# EAGLE design fa3d_Dock_NEW_Small (EAGLE 9.4.2)
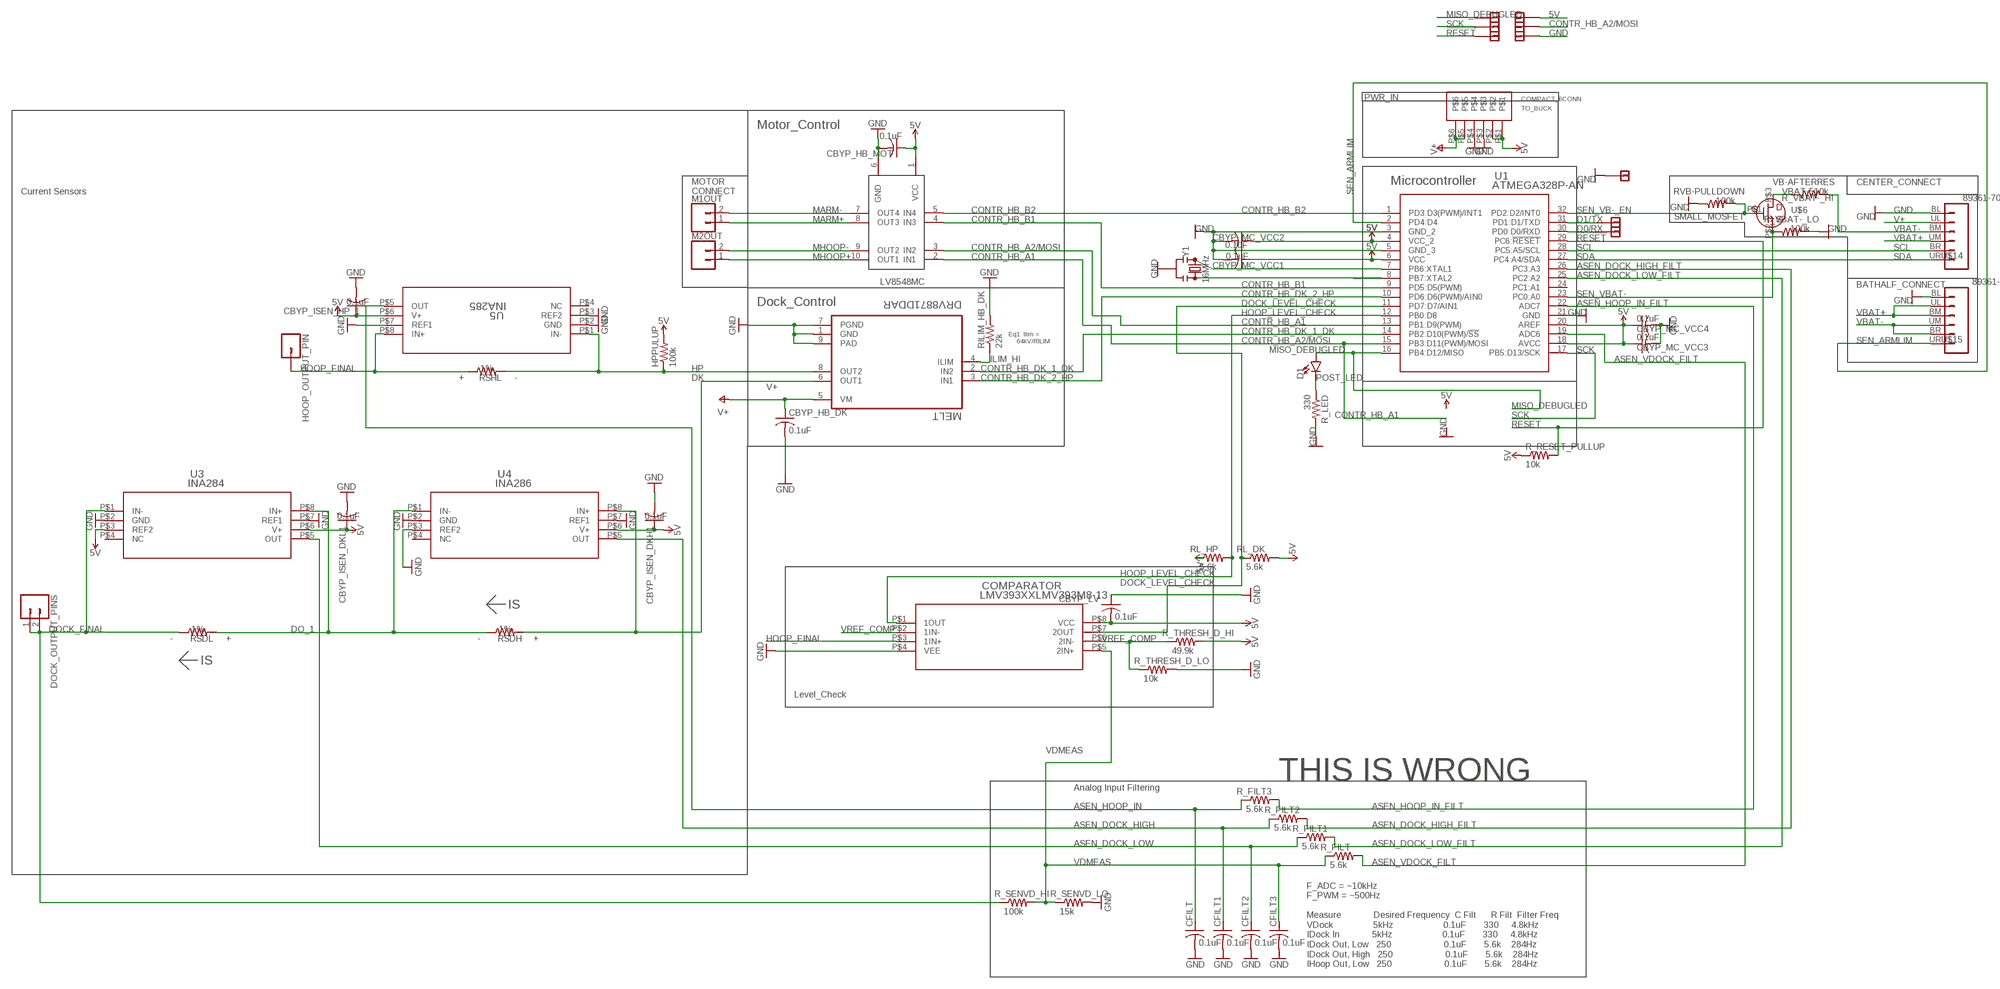
[diagram p0: schematic, sheet 1, part 1 of 2]
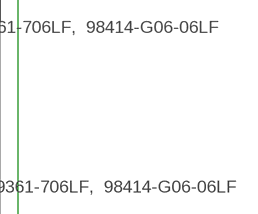
[diagram p1: schematic, sheet 1, part 2 of 2]

## Parts
CBYP_HB_DK  0.1uF  C-USC0603  [C0603]
CBYP_HB_MOT  0.1uF  C-USC0402  [C0402]
CBYP_ISEN_DKH1  0.1uF  C-USC0402  [C0402]
CBYP_ISEN_DKL1  0.1uF  C-USC0402  [C0402]
CBYP_ISEN_HP_1  0.1uF  C-USC0402  [C0402]
CBYP_LV  0.1uF  C-USC0402  [C0402]
CBYP_MC_VCC1  0.1uF  C-USC0402  [C0402]
CBYP_MC_VCC2  0.1uF  C-USC0402  [C0402]
CBYP_MC_VCC3  0.1uF  C-USC0402  [C0402]
CBYP_MC_VCC4  0.1uF  C-USC0402  [C0402]
CFILT  0.1uF  C-USC0402  [C0402]
CFILT1  0.1uF  C-USC0402  [C0402]
CFILT2  0.1uF  C-USC0402  [C0402]
CFILT3  0.1uF  C-USC0402  [C0402]
COMPARATOR  LMV393XXLMV393M8-13  [MSOP-8]
D1  LED0603  [LED-0603]
DOCK_OUTPUT_PINS  CONN_02  [1X02]
HOOP_OUTPUT_PIN  CONN_01  [1X01]
HPPULUP  100k  R-US_R0402  [R0402]
M1OUT  CONN_02  [1X02]
M2OUT  CONN_02  [1X02]
MELT  DRV8871DDAR  [SOIC127P600X170-8N]
MOTOR  LV8548MC-AH  [10-SOP]
R_FILT  5.6k  R-US_R0402  [R0402]
R_FILT1  5.6k  R-US_R0402  [R0402]
R_FILT2  5.6k  R-US_R0402  [R0402]
R_FILT3  5.6k  R-US_R0402  [R0402]
R_LED  330  R-US_R0402  [R0402]
R_RESET_PULLUP  10k  R-US_R0402  [R0402]
R_SENVD_HI  100k  R-US_R0402  [R0402]
R_SENVD_LO  15k  R-US_R0402  [R0402]
R_THRESH_D_HI  49.9k  R-US_R0402  [R0402]
R_THRESH_D_LO  10k  R-US_R0402  [R0402]
R_VBAT-_HI  510k  R-US_R0402  [R0402]
R_VBAT-_LO  100k  R-US_R0402  [R0402]
RILIM_HB_DK  22k  R-US_R0603  [R0603]
RL_DK  5.6k  R-US_R0402  [R0402]
RL_HP  5.6k  R-US_R0402  [R0402]
RSDH  25m  R-US_R0603  [R0603]
RSDL  25m  R-US_R0603  [R0603]
RSHL  25m  R-US_R0603  [R0603]
RVB-PULLDOWN  100k  R-US_R0402  [R0402]
TO_BUCK  COMPACT_6CONN  [COMPACT_6CONN]
U1  ATMEGA328P-AN  [32A]
U3  INA284  INA28XSMALL  [8-VSSOP]
U4  INA286  INA28XSMALL  [8-VSSOP]
U5  INA285  INA28XSMALL  [8-VSSOP]
U$1  SIMPLE_VIA_CONNECTION  [SIMPLEVIA]
U$2  SIMPLE_VIA_CONNECTION  [SIMPLEVIA]
U$3  SIMPLE_VIA_CONNECTION  [SIMPLEVIA]
U$4  SIMPLE_VIA_CONNECTION  [SIMPLEVIA]
U$5  SIMPLE_VIA_CONNECTION  [SIMPLEVIA]
U$6  SMALL_MOSFET  [SOT-23]
U$7  SIMPLE_VIA_CONNECTION  [SIMPLEVIA]
U$8  SIMPLE_VIA_CONNECTION  [SIMPLEVIA]
U$9  SIMPLE_VIA_CONNECTION  [SIMPLEVIA]
U$10  SIMPLE_VIA_CONNECTION  [SIMPLEVIA]
U$14  89361-706LF, 98414-G06-06LF  CONNECTORHEADERTHROUGHHOLE6POSITION0.079"(2.00MM)  [2X3_2MMPITCH]
U$15  89361-706LF, 98414-G06-06LF  CONNECTORHEADERTHROUGHHOLE6POSITION0.079"(2.00MM)  [2X3_2MMPITCH]
Y1  16MHz  RESONATOR-16MHZSMD_3.2X1.3  [RESONATOR-SMD-3.2X1.3]

## Nets
5V [Analog_Signal]: CBYP_HB_MOT.1 CBYP_ISEN_DKH1.1 CBYP_ISEN_DKL1.1 CBYP_ISEN_HP_1.1 CBYP_LV.2 CBYP_MC_VCC1.1 CBYP_MC_VCC2.1 CBYP_MC_VCC3.1 CBYP_MC_VCC4.1 COMPARATOR.P$8(VCC) HPPULUP.2 MOTOR.1(VCC) R_RESET_PULLUP.1 R_THRESH_D_HI.2 RL_DK.2 RL_HP.1 TO_BUCK.P$1 TO_BUCK.P$2 U1.4(VCC_2) U1.6(VCC) U1.18(AVCC) U1.20(AREF) U3.P$3(REF2) U3.P$6(V+) U4.P$6(V+) U5.P$6(V+) U$10.P$1
!RESET [Digital_Signal]: R_RESET_PULLUP.2 U1.29(PC6:!RESET) U$7.P$1
ASEN_DOCK_HIGH [Analog_Signal]: CFILT1.1 R_FILT2.1 U4.P$5(OUT)
ASEN_DOCK_HIGH_FILT [Analog_Signal]: R_FILT2.2 U1.26(PC3:A3)
ASEN_DOCK_LOW [Analog_Signal]: CFILT2.1 R_FILT1.1 U3.P$5(OUT)
ASEN_DOCK_LOW_FILT [Analog_Signal]: R_FILT1.2 U1.25(PC2:A2)
ASEN_HOOP_IN [Analog_Signal]: CFILT.1 R_FILT3.1 U5.P$5(OUT)
ASEN_HOOP_IN_FILT [Analog_Signal]: R_FILT3.2 U1.22(ADC7)
ASEN_VDOCK_FILT [Analog_Signal]: R_FILT.2 U1.19(ADC6)
CONTR_HB_A1 [Digital_Signal]: MOTOR.2(IN1) U1.15(PB3:D11(PWM)/MOSI)
CONTR_HB_A2/MOSI [Digital_Signal]: MOTOR.3(IN2) U1.13(PB1:D9(PWM)) U$9.P$1
CONTR_HB_B1 [Digital_Signal]: MOTOR.4(IN3) U1.9(PD5:D5(PWM))
CONTR_HB_B2 [Digital_Signal]: MOTOR.5(IN4) U1.1(PD3:D3(PWM)/INT1)
CONTR_HB_DK_1_DK [Digital_Signal]: MELT.2(IN2) U1.14(PB2:D10(PWM)/!SS)
CONTR_HB_DK_2_HP [Digital_Signal]: MELT.3(IN1) U1.10(PD6:D6(PWM)/AIN0)
D0/RX [Communication]: U1.30(PD0:D0/RXD) U$5.P$1
D1/TX [Communication]: U1.31(PD1:D1/TXD) U$4.P$1
DK [Power_Signal]: MELT.6(OUT1) RSDH.2 U4.P$8(IN+)
DO_1 [Communication]: RSDH.1 RSDL.2 U3.P$8(IN+) U4.P$1(IN-)
DOCK_FINAL [Communication]: DOCK_OUTPUT_PINS.1 DOCK_OUTPUT_PINS.2 R_SENVD_HI.1 RSDL.1 U3.P$1(IN-)
DOCK_LEVEL_CHECK [Digital_Signal]: COMPARATOR.P$7(2OUT) RL_DK.1 U1.11(PD7:D7/AIN1)
GND [Digital_Signal]: CBYP_HB_DK.2 CBYP_HB_MOT.2 CBYP_ISEN_DKH1.2 CBYP_ISEN_DKL1.2 CBYP_ISEN_HP_1.2 CBYP_LV.1 CBYP_MC_VCC1.2 CBYP_MC_VCC2.2 CBYP_MC_VCC3.2 CBYP_MC_VCC4.2 CFILT1.2 CFILT2.2 CFILT3.2 CFILT.2 COMPARATOR.P$4(VEE) MELT.1(GND) MELT.7(PGND) MELT.9(PAD) MOTOR.6(GND) R_LED.2 R_SENVD_LO.2 R_THRESH_D_LO.2 R_VBAT-_LO.2 RILIM_HB_DK.2 RVB-PULLDOWN.1 TO_BUCK.P$3 TO_BUCK.P$4 U1.3(GND_2) U1.5(GND_3) U1.21(GND) U3.P$2(GND) U3.P$7(REF1) U4.P$2(GND) U4.P$3(REF2) U4.P$7(REF1) U5.P$2(GND) U5.P$3(REF2) U5.P$7(REF1) U$1.P$1 U$8.P$1 U$14.BL U$15.BL Y1.2
HOOP_FINAL [Communication]: COMPARATOR.P$3(1IN+) HOOP_OUTPUT_PIN.1 RSHL.1 U5.P$8(IN+)
HOOP_LEVEL_CHECK [Digital_Signal]: COMPARATOR.P$1(1OUT) RL_HP.2 U1.12(PB0:D8)
HP [Communication]: HPPULUP.1 MELT.8(OUT2) RSHL.2 U5.P$1(IN-)
ILIM_HI [Analog_Signal]: MELT.4(ILIM) RILIM_HB_DK.1
MARM+ [Motor]: M1OUT.1 MOTOR.8(OUT3)
MARM- [Motor]: M1OUT.2 MOTOR.7(OUT4)
MHOOP+ [Motor]: M2OUT.1 MOTOR.10(OUT1)
MHOOP- [Motor]: M2OUT.2 MOTOR.9(OUT2)
MISO_DEBUGLED [Communication]: D1.A U1.16(PB4:D12/MISO) U$2.P$1
POST_LED [Digital_Signal]: D1.C R_LED.1
SCK [Digital_Signal]: U1.17(PB5:D13/SCK) U$3.P$1
SCL [Communication]: U1.28(PC5:A5/SCL) U$14.BR
SDA [Communication]: U1.27(PC4:A4/SDA) U$14.UR
SEN_ARMLIM [Digital_Signal]: U1.2(PD4:D4) U$15.UR
SEN_VB-_EN [Digital_Signal]: RVB-PULLDOWN.2 U1.32(PD2:D2/INT0) U$6.P$1(G)
SEN_VBAT- [Analog_Signal]: R_VBAT-_LO.1 U1.23(PC0:A0) U$6.P$2(S)
V+ [Power_Signal]: CBYP_HB_DK.1 MELT.5(VM) TO_BUCK.P$5 TO_BUCK.P$6 U$14.UL
VB-AFTERRES [Analog_Signal]: R_VBAT-_HI.1 U$6.P$3(D)
VBAT+ [Power_Signal]: U$14.UM U$15.BM U$15.UL
VBAT- [Power_Signal]: R_VBAT-_HI.2 U$14.BM U$15.BR U$15.UM
VDMEAS [Analog_Signal]: CFILT3.1 COMPARATOR.P$5(2IN+) R_FILT.1 R_SENVD_HI.2 R_SENVD_LO.1
VREF_COMP [Analog_Signal]: COMPARATOR.P$2(1IN-) COMPARATOR.P$6(2IN-) R_THRESH_D_HI.1 R_THRESH_D_LO.1
XTAL1/TOSC1 [Communication]: U1.7(PB6:XTAL1) Y1.1
XTAL2/TOSC2 [Communication]: U1.8(PB7:XTAL2) Y1.3
Unconnected: U1.24(PC1:A1) U3.P$4(NC) U4.P$4(NC) U5.P$4(NC)

## Notes on the sheet
- PWR_IN
- Motor_Control
- Microcontroller | CENTER_CONNECT
- Current Sensors
- MOTOR
  CONNECT
- BATHALF_CONNECT
- Dock_Control
- Eq1: Ilim = 
      64kV/RILIM
- + | -
- IS
- - | + | - | +
- IS
- Level_Check
- THIS IS WRONG
- Analog Input Filtering
- F_ADC = ~10kHz
  F_PWM = ~500Hz
  
  Measure             Desired Frequency  C Filt      R Filt  Filter Freq
  VDock                5kHz                    0.1uF       330     4.8kHz
  IDock In             5kHz                    0.1uF       330     4.8kHz
  IDock Out, Low   250                     0.1uF       5.6k    284Hz
  IDock Out, High   250                     0.1uF       5.6k    284Hz
  IHoop Out, Low   250                     0.1uF       5.6k    284Hz

## Library data of the parts
CBYP_HB_DK = resistor:C-US: CAPACITOR, American symbol; PARTNO: CL10B104KB8NNNC
CBYP_HB_MOT CBYP_ISEN_DKH1 CBYP_ISEN_DKL1 CBYP_ISEN_HP_1 CBYP_LV CBYP_MC_VCC1-CBYP_MC_VCC4 CFILT CFILT1-CFILT3 = resistor:C-US: CAPACITOR, American symbol; PARTNO: 885012105010
COMPARATOR = FA3D_lib:LMV393XX; PARTNO: LMV393M8-13
D1 = SparkFun-LED:LED: LED (Generic) Standard schematic elements and footprints for 5mm, 3mm, 1206, and 0603 sized LEDs. Generic LEDs with no color specified.; PARTNO: SML-D12U1WT86
DOCK_OUTPUT_PINS M1OUT M2OUT = SparkFun-Connectors:CONN_02: Multi connection point. Often used as Generic Header-pin footprint for 0.1 inch spaced/style header connections On any of the 0.1 inch spaced packages, you can populate with these: Break Away Headers - Straight <https://www.sparkfun.com/products/116> (PRT-00116) Break Away Male Headers - Right Angle <https://www.sparkfun.com/products/553> (PRT-00553) Female Headers <https://www.sparkfun.com/products/115> (PRT-00115) Break Away Headers - Machine Pin <https://www.sparkfun.com/products/117> (PRT-00117) Break Away Female Headers - Swiss Machine Pin <https://www.sparkfun.com/products/743> (PRT-00743) For SCREWTERMINALS and SPRING TERMINALS visit here: Screw Terimnals on SparkFun.com <https://www.sparkfun.com/search/results?term=Screw+Terminals> (5mm/3.5mm/2.54mm spacing) This device is also useful as a general connection point to wire up your design to another part of your project. Our various solder wires solder well into these plated through hole pads. Hook-Up Wire - Assortment (Stranded, 22 AWG) <https://www.sparkfun.com/products/11375> (PRT-11375) Hook-Up Wire - Assortment (Solid Core, 22 AWG) <https://www.sparkfun.com/products/11367> (PRT-11367) View the entire wire category on our website here <https://www.sparkfun.com/categories/141> Special notes: Molex polarized connector foot print use with: PRT-08233 with associated crimp pins and housings. 2.54_SCREWTERM for use with PRT-10571. 3.5mm Screw Terminal footprints for PRT-08084 5mm Screw Terminal footprints for use with PRT-08432
HOOP_OUTPUT_PIN = SparkFun-Connectors:CONN_01: Single connection point. Often used as Generic Header-pin footprint for 0.1 inch spaced/style header connections On any of the 0.1 inch spaced packages, you can populate with these: Break Away Headers - Straight <https://www.sparkfun.com/products/116> (PRT-00116) Break Away Male Headers - Right Angle <https://www.sparkfun.com/products/553> (PRT-00553) Female Headers <https://www.sparkfun.com/products/115> (PRT-00115) Break Away Headers - Machine Pin <https://www.sparkfun.com/products/117> (PRT-00117) Break Away Female Headers - Swiss Machine Pin <https://www.sparkfun.com/products/743> (PRT-00743) This device is also useful as a general connection point to wire up your design to another part of your project. Our various solder wires solder well into these plated through hole pads. Hook-Up Wire - Assortment (Stranded, 22 AWG) <https://www.sparkfun.com/products/11375> (PRT-11375) Hook-Up Wire - Assortment (Solid Core, 22 AWG) <https://www.sparkfun.com/products/11367> (PRT-11367) View the entire wire category on our website here <https://www.sparkfun.com/categories/141> Special notes: SMTSO-256-ET is a "flush mount" nut for a 4-40 screw. We mostly use this on specialty testbeds; it is a nice way to connect hardware to your PCB at an adjustable hieght. Also note, the SNAP packages are for using a snappable style connector. We sell a baggie of snaps and they are also used on two LilyPad designs: Snap Assortment - 30 pack (male and female) <https://www.sparkfun.com/products/11347> (DEV-11347) LilyPad Arduino SimpleSnap <https://www.sparkfun.com/products/10941> (DEV-10941) LilyPad SimpleSnap Protoboard <https://www.sparkfun.com/products/10940> (DEV-10940)
HPPULUP R_SENVD_HI R_VBAT-_LO RVB-PULLDOWN = resistor:R-US_: RESISTOR, American symbol; PARTNO: RMCF0402JT100K
MELT = DRV8871DDAR:DRV8871DDAR: 3.6A Brushed DC Motor Driver with Integrated Current Sensing (PWM Ctrl) 8-SO PowerPAD -40 to 125; DESCRIPTION: 3.6A Brushed DC Motor Driver with Integrated Current Sensing _PWM Ctrl_ 8-SO PowerPAD -40 to 125; DIGI-KEY_PART_NUMBER: 296-43024-1-ND; DIGI-KEY_PURCHASE_URL: https://www.digikey.com/product-detail/en/texas-instruments/DRV8871DDAR/296-43024-1-ND/5722182?utm_source=snapeda&utm_medium=aggregator&utm_campaign=symbol; MF: Texas Instruments; MP: DRV8871DDAR; PACKAGE: SO-8 Texas Instruments; PARTNO: DRV8871DDAR
MOTOR = FA3D_lib:LV8548MC-AH; PARTNO: LV8548MC-AH
R_FILT R_FILT1-R_FILT3 RL_DK RL_HP = resistor:R-US_: RESISTOR, American symbol; PARTNO: CRGCQ0402F5K6
R_LED = resistor:R-US_: RESISTOR, American symbol; PARTNO: RMCF0402JT330R
R_RESET_PULLUP R_THRESH_D_LO = resistor:R-US_: RESISTOR, American symbol; PARTNO: RR0510P-103-D
R_SENVD_LO = resistor:R-US_: RESISTOR, American symbol; PARTNO: RMCF0402JT15K0
R_THRESH_D_HI = resistor:R-US_: RESISTOR, American symbol; PARTNO: RMCF0402FT49K9
R_VBAT-_HI = resistor:R-US_: RESISTOR, American symbol; PARTNO: RMCF0402JT510K
RILIM_HB_DK = resistor:R-US_: RESISTOR, American symbol; PARTNO: RMCF0402JT22K0
RSDH RSDL RSHL = resistor:R-US_: RESISTOR, American symbol; PARTNO: ERJ-3BWFR025V; SIZE: 1206; TOL: 1%
TO_BUCK = FA3D_lib:COMPACT_6CONN
U1 = FA3D_lib:ATMEGA328P-AN; MANUFACTURER_PART_NUMBER: ATMEGA328PAN; PARTNO: ATMEGA328P-AUR; VENDOR: Atmel
U3 = FA3D_lib:INA28X; PARTNO: INA284AIDGKR
U4 = FA3D_lib:INA28X; PARTNO: INA286AIDGKR
U5 = FA3D_lib:INA28X; PARTNO: INA285AIDGKR
U$1-U$5 U$7-U$10 = FA3D_lib:SIMPLE_VIA_CONNECTION
U$6 = FA3D_lib:SMALL_MOSFET; PARTNO: BSS138
U$14 U$15 = FA3D_lib:CONNECTORHEADERTHROUGHHOLE6POSITION0.079"(2.00MM); PARTNO: 98414-G06-06LF
Y1 = SparkFun-Clocks:RESONATOR-16MHZ: 16MHz Resonator Digikey Example <http://www.digikey.com/product-detail/en/murata-electronics-north-america/CSTCE16M0V53-R0/490-1198-1-ND/584635> Frequency: 16MHz Frequency Stability: ±0.3% Frequency Tolerance: ±0.5% Capacitance: 15pF SparkFun Products SparkFun OpenLog <https://www.sparkfun.com/products/13712> SparkFun MicroView - OLED Arduino Module <https://www.sparkfun.com/products/12923>; PARTNO: CSTNE16M0V530000R0; PROD_ID: XTAL-08900

## Net classes
0 default: drill 0.3 mm
1 Analog_Signal: width 0.2 mm, drill 0.3 mm, clearance 0.05 mm
2 Digital_Signal: width 0.15 mm, drill 0.3 mm, clearance 0.05 mm
3 Power_Signal: width 0.7 mm, drill 0.5 mm, clearance 0.1 mm
4 Communication: width 0.2 mm, drill 0.3 mm, clearance 0.05 mm
5 Motor: width 0.4 mm, drill 0.3 mm, clearance 0.07 mm
6 Logic_Supply: width 0.2 mm, drill 0.3 mm, clearance 0.05 mm

## Board
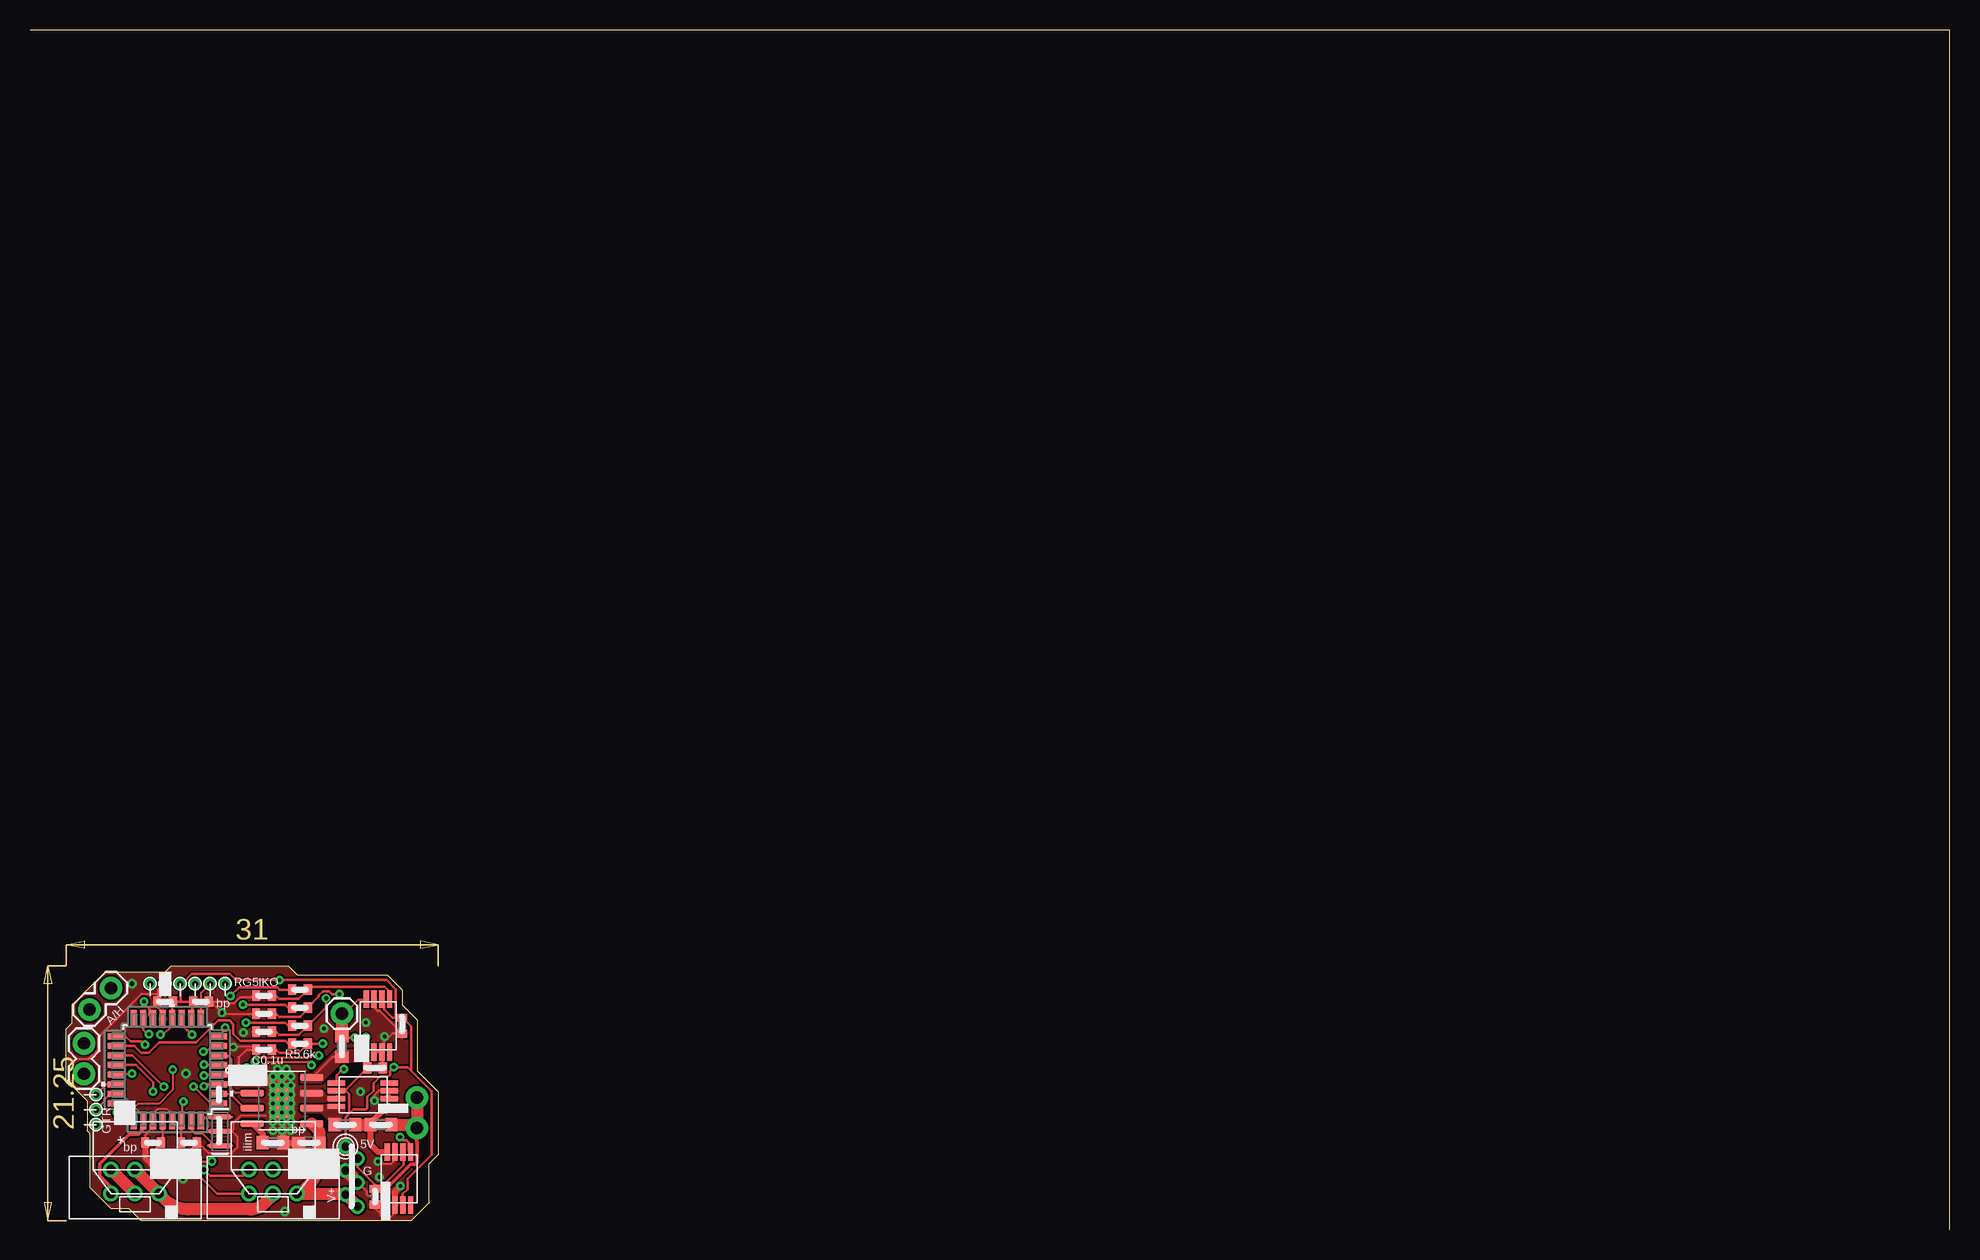
[diagram p2: board, top side]
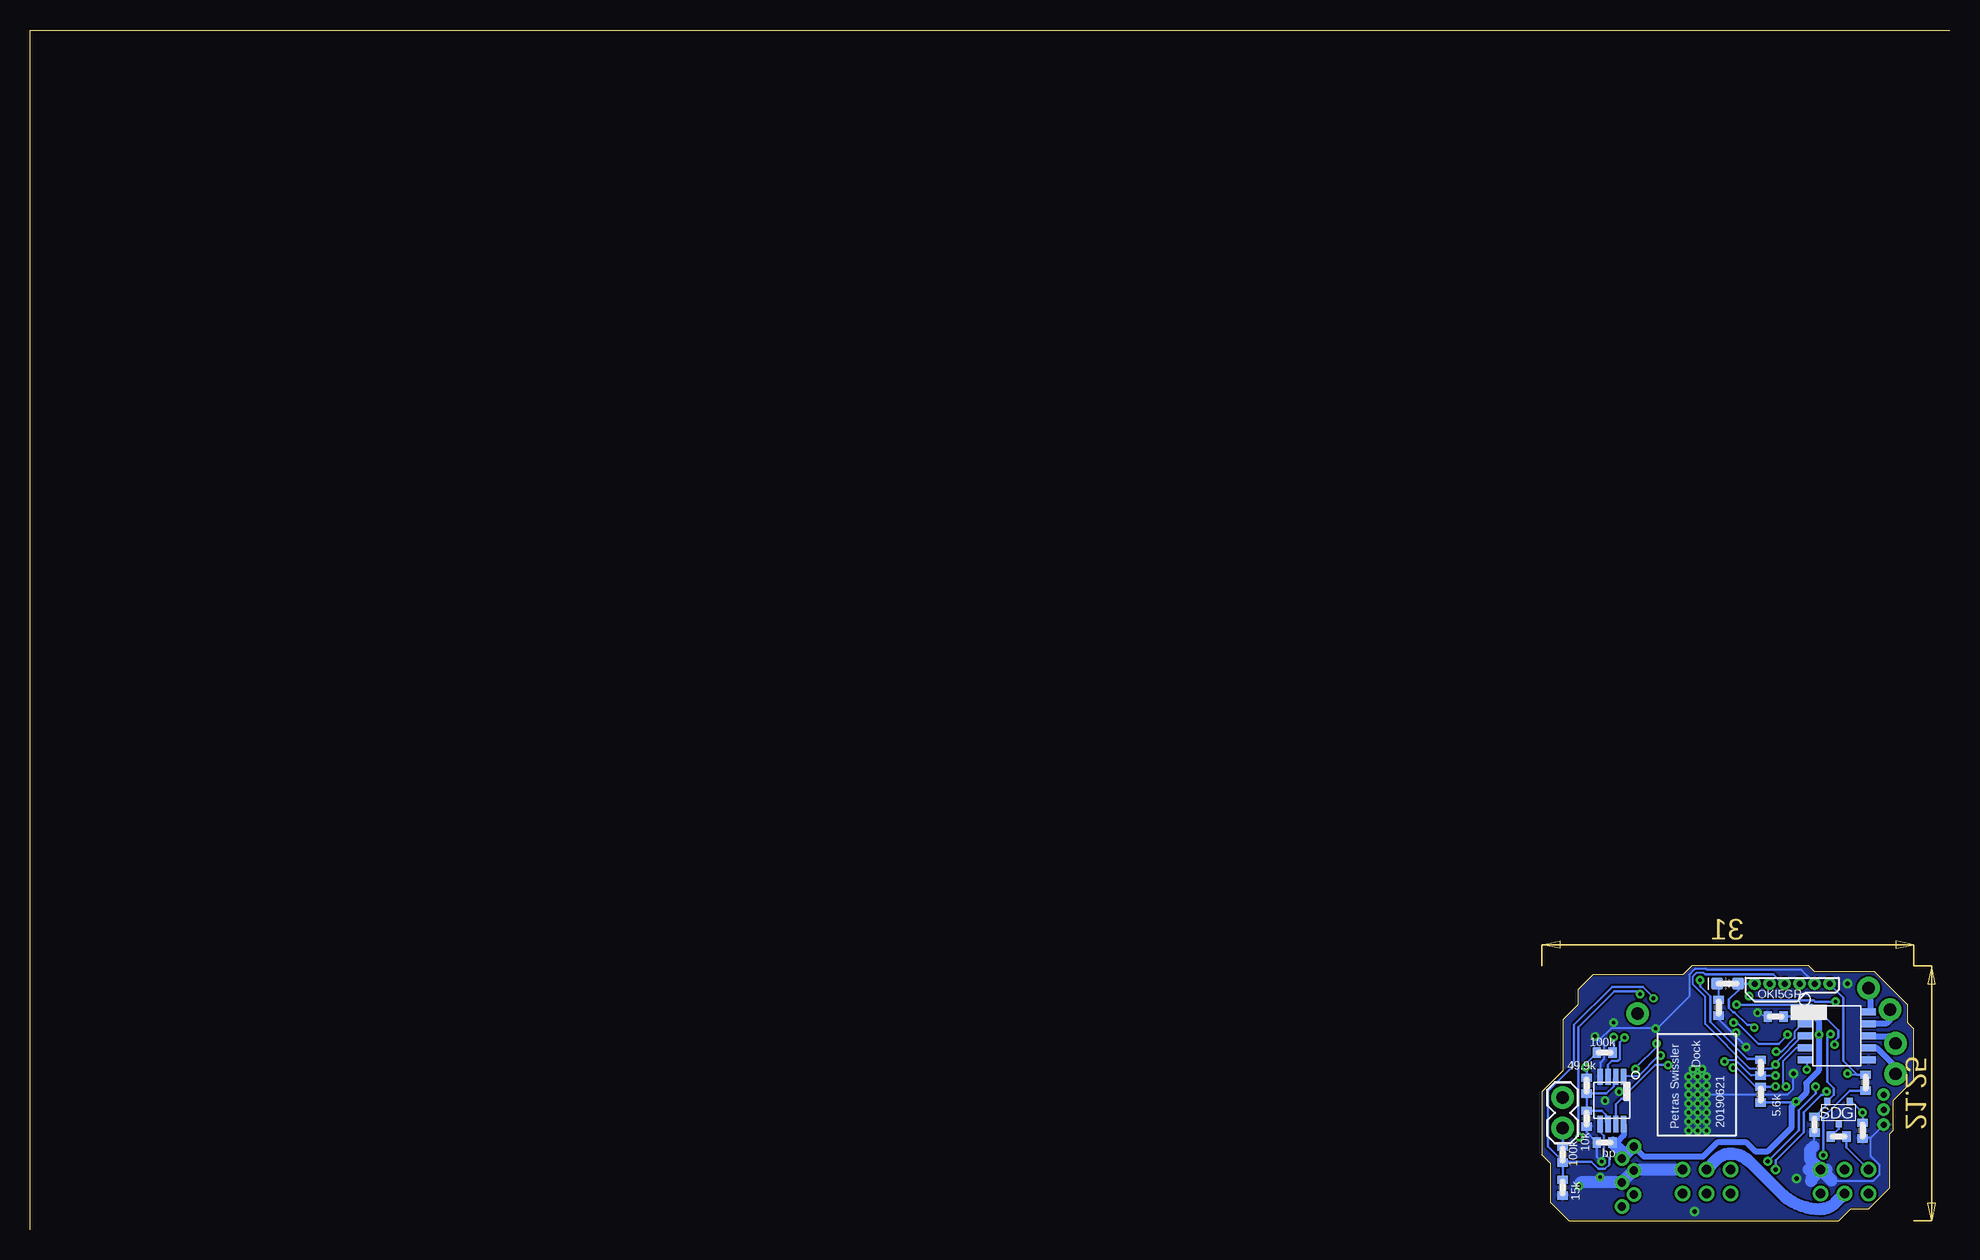
[diagram p3: board, bottom side, seen from below]

Size 160 x 100 mm. Coordinates in mm from the lower left corner, seen from the top.
Outline: 160,0 160,100 0,100
Outline: 3,12.5 3,16.75 3.5,17.25 3.5,18.75 6.25,21.5 11.25,21.5 11.75,22 21.5,22 22.25,21.25 29.75,21.25 31,20 31,18.75 32.25,17.5 32.25,13.25 34,11.5 34,6.25 33.25,5.5 33.25,2.25 31.75,0.75 9.25,0.75 8.25,1.75 6.75,1.75 5,3.5 5,8 4.75,8.25 4.75,10.75 3,12.5
Copper layers (1*16): Top 0.035mm / dielectric 1.5mm / Bottom 0.035mm
Design rules "Swissler_Aggressive": minimum track width 0.1mm, minimum drill 0.3mm, track to track 0.15mm, track to pad 0.15mm, pad to pad 0.15mm, via to via 0.15mm, smd to smd 0.1mm, copper to edge 0.1mm, drill to drill 0.1mm, minimum pad ring 10mil, minimum via ring 8mil, stop-mask expansion 4mil, vias tented up to drill 25mil, thermal gap 0.125mm

### Footprints (pad centres in the part's own frame; a part is rotated, then mirrored left to right if it is on the bottom)
C0603 = smd 1.1 x 1: 1 -0.85,0; 2 0.85,0
C0402 = smd 0.7 x 0.9: 1 -0.65,0; 2 0.65,0
MSOP-8 = smd 0.45 x 1.35: P$1 -0.975,-1.975; P$2 -0.325,-1.975; P$3 0.325,-1.975; P$4 0.975,-1.975; P$5 0.975,1.975; P$6 0.325,1.975; P$7 -0.325,1.975; P$8 -0.975,1.975
LED-0603 = smd 1 x 1: A -0.877,0; C 0.877,0
1X02 = drill 1.016 pad 1.88: 1 0,0; 2 2.54,0
1X01 = drill 1.016 pad 1.88: 1 0,0
R0402 = smd 0.7 x 0.9: 1 -0.65,0; 2 0.65,0
SOIC127P600X170-8N = smd 1.97 x 0.6: 1 -2.475,1.905; 2 -2.475,0.635; 3 -2.475,-0.635; 4 -2.475,-1.905; 5 2.475,-1.905; 6 2.475,-0.635; 7 2.475,0.635; 8 2.475,1.905 | smd 2.02 x 2.87: 9 0,0
10-SOP = smd 0.58 x 1.18: 1 -2,-2.66; 2 -1,-2.66; 3 0,-2.66; 4 1,-2.66; 5 2,-2.66; 6 2,2.66; 7 1,2.66; 8 0,2.66; 9 -1,2.66; 10 -2,2.66
R0603 = smd 1 x 1.1: 1 -0.85,0; 2 0.85,0
COMPACT_6CONN = drill 0.7: P$1 -3,0; P$2 -2,1; P$3 -1,0; P$4 0,1; P$5 1,0; P$6 2,1
32A = smd 1.461 x 0.501: 1 -4.25,2.8; 2 -4.25,2; 3 -4.25,1.2; 4 -4.25,0.4; 5 -4.25,-0.4; 6 -4.25,-1.2; 7 -4.25,-2; 8 -4.25,-2.8; 17 4.25,-2.8; 18 4.25,-2; 19 4.25,-1.2; 20 4.25,-0.4; 21 4.25,0.4; 22 4.25,1.2; 23 4.25,2; 24 4.25,2.8 | smd 0.501 x 1.461: 9 -2.8,-4.25; 10 -2,-4.25; 11 -1.2,-4.25; 12 -0.4,-4.25; 13 0.4,-4.25; 14 1.2,-4.25; 15 2,-4.25; 16 2.8,-4.25; 25 2.8,4.25; 26 2,4.25; 27 1.2,4.25; 28 0.4,4.25; 29 -0.4,4.25; 30 -1.2,4.25; 31 -2,4.25; 32 -2.8,4.25
8-VSSOP = smd 0.45 x 1.45: P$1 -0.975,-2.2; P$2 -0.325,-2.2; P$3 0.325,-2.2; P$4 0.975,-2.2; P$5 0.975,2.2; P$6 0.325,2.2; P$7 -0.325,2.2; P$8 -0.975,2.2
SIMPLEVIA = drill 0.5: P$1 0,0
SOT-23 = smd 0.5 x 0.6: P$1 -0.95,-0.925; P$2 0.95,-0.925; P$3 0,0.925
2X3_2MMPITCH = drill 0.8: BL -2,-1; BM 0,-1; BR 2,-1; UL -2,1; UM 0,1; UR 2,1
RESONATOR-SMD-3.2X1.3 = smd 0.45 x 1.905: 1 -1.2,0; 2 0,0; 3 1.2,0

### Placement (x,y rotation side)
CBYP_HB_DK  23.25,7.25 180 top
CBYP_HB_MOT  14.5,17.75 180 bottom
CBYP_ISEN_DKH1  28.76,13.47 0 top
CBYP_ISEN_DKL1  28.75,2.75 270 top
CBYP_ISEN_HP_1  31,17 270 top
CBYP_LV  28.75,7.25 0 bottom
CBYP_MC_VCC1  10.25,7.25 180 top
CBYP_MC_VCC2  13.25,7.25 0 top
CBYP_MC_VCC3  11.25,19 180 top
CBYP_MC_VCC4  14.25,19 0 top
CFILT  19.5,19.5 180 top
CFILT1  19.5,15 180 top
CFILT2  19.5,18 180 top
CFILT3  19.5,16.5 180 top
COMPARATOR  28.14,10.76 180 bottom
D1  18.5,20.5 180 bottom
DOCK_OUTPUT_PINS  32.25,11 270 bottom
HOOP_OUTPUT_PIN  26,18 0 top
HPPULUP  28.75,14.75 180 bottom
M1OUT  4.5,15.52 270 top
M2OUT  6.75,20.13 225 top
MELT  21,10.75 0 top
MOTOR  9.41,16.14 270 bottom
R_FILT  22.5,17 180 top
R_FILT1  22.5,18.5 180 top
R_FILT2  22.5,15.5 180 top
R_FILT3  22.5,20 180 top
R_LED  19.25,18.5 270 bottom
R_RESET_PULLUP  7,12.25 90 bottom
R_SENVD_HI  32.25,6.25 270 bottom
R_SENVD_LO  32.25,3.5 270 bottom
R_THRESH_D_HI  30.25,12 90 bottom
R_THRESH_D_LO  30.25,9.25 270 bottom
R_VBAT-_HI  9.25,7.75 0 bottom
R_VBAT-_LO  11.25,8.75 270 bottom
RILIM_HB_DK  20.25,7.25 0 top
RL_DK  15.75,11.25 270 bottom
RL_HP  15.75,13.5 270 bottom
RSDH  26.25,8.75 180 top
RSDL  29.25,8.75 180 top
RSHL  26,15.25 270 top
RVB-PULLDOWN  7.25,8.25 90 bottom
TO_BUCK  26.31,3.92 270 top
U1  11.45,13.32 90 top
U3  30.75,4.25 0 top
U4  27.75,11.25 90 top
U5  29,17 0 top
U$1  5.5,8.75 270 top
U$2  16.25,20.5 0 top
U$3  15,20.5 0 top
U$4  5.5,10 270 top
U$5  5.5,11.25 270 top
U$6  9.25,9.75 180 bottom
U$7  10,20.5 0 top
U$8  11.25,20.5 0 top
U$9  13.75,20.5 0 top
U$10  12.5,20.5 0 top
U$14  20.25,4 180 top
U$15  8.75,4 180 top
Y1  15.83,8.18 90 top

### Tracks (layer width: path | path; a pad name or v marks a point on that pad's centre or on a via)
5V  (via drill 0.3, 0.35)
  Top 0.2: U5.P$6 29.5,19.02 29.5,18.37 30.22,17.65 30.47,17.65 | 30.47,17.65 CBYP_ISEN_HP_1.1 31.07,17.61 31.75,16.94 31.75,13.25 | CBYP_MC_VCC2.1 12.6,8.09 | 12.6,8.09 12.6,9.02 U1.6 12.7,9.15 12.7,10.58 v12.78,10.66 | U1.4 11.05,8.09 | 11.05,8.09 11.05,7.4 CBYP_MC_VCC1.1 10.89,7.18 10.51,6.8 v10.51,6.2 | 11.05,8.09 12.6,8.09 | 26.31,11.64 27.9,13.23 27.89,13.25 CBYP_ISEN_DKH1.1 | 26.31,11.64 25.55,11.64 U4.P$6 | 26.61,9.68 26.61,11.26 26.31,11.57 26.31,11.64 | 26.61,9.68 26.31,9.37 26.31,7.41 TO_BUCK.P$1 | U1.18 13.46,17.61 13.53,17.69 13.53,18.98 CBYP_MC_VCC4.1 13.46,18.98 12.55,18.98 | 12.55,18.98 11.95,18.98 CBYP_MC_VCC3.1 11.87,18.98 11.87,17.61 U1.20 11.79,17.54 11.79,16.93 11.11,16.25 v10.89,16.25 | 12.55,18.98 12.55,20.41 U$10.P$1 12.68,20.5 13.48,21.3 16.63,21.3 17.14,20.79 v20.79,20.79 29.71,20.79 30.47,20.03 30.47,17.65 | TO_BUCK.P$2 27.31,5.19 28.75,3.75 CBYP_ISEN_DKL1.1 29.15,3.4 31.15,5.4 31.15,6.38 U3.P$6 | 31.75,13.25 31.47,13.53 v30.32,13.53 30.01,13.23 30.01,12.92 29.86,12.77 29.19,12.77 28.63,12.21 28.63,11.57 28.11,11.05 28.11,10.11 28.03,10.03 26.97,10.03 26.61,9.68 | 31.75,13.25 33.49,11.51 33.49,6.24 31.47,4.22 31.47,3.37 31.07,2.98 U3.P$3
  Top 1: TO_BUCK.P$1 TO_BUCK.P$2
  Bottom 0.2: 27.75,7.25 28.05,7.25 CBYP_LV.2 | v10.51,6.2 10.51,9.37 8.32,11.57 7.03,11.57 R_RESET_PULLUP.1 | CBYP_HB_MOT.1 13.84,17.77 12.47,17.77 12.25,17.99 MOTOR.1 | 12.74,10.62 12.76,10.64 v12.78,10.66 12.84,10.6 RL_DK.2 | RL_HP.1 15.8,14.21 16.84,14.21 19.94,17.31 19.94,17.39 19.95,17.4 19.95,19.45 20.79,20.29 v20.79,20.79 | 30.24,13.53 30.24,13.91 HPPULUP.2 | 30.24,13.53 30.24,12.7 R_THRESH_D_HI.2 | v30.32,13.53 30.24,13.53 | v10.89,16.25 v10.9,16.25
  Bottom 0.5: MOTOR.1 12.01,18.08 11.56,18.08 10.9,17.42 v10.9,16.25 10.9,13.25 11.95,12.2 11.95,11.41 12.74,10.62 | 12.76,10.64 13.16,10.25 13.16,8.52 15.15,6.53 16.2,6.53 16.94,7.27 19.36,7.27 20.54,6.08 25.47,6.08 TO_BUCK.P$1 | COMPARATOR.P$8 27.16,7.83 27.75,7.25
  Bottom 1: 28.05,7.25 28.05,7.2 27.31,6.46 TO_BUCK.P$2 TO_BUCK.P$1
!RESET  (via drill 0.3)
  Top 0.152: v8.5,13 8.42,12.92 U1.29
  Bottom 0.152: v8.5,13 8.4,12.9 R_RESET_PULLUP.2
  Bottom 0.2: R_RESET_PULLUP.2 7.7,12.9 8.85,14.05 8.85,19.3 10,20.45 U$7.P$1
ASEN_DOCK_HIGH  (via drill 0.3)
  Top 0.2: CFILT1.1 20.5,15 20.75,14.74 22.39,14.74 R_FILT2.1 v24.4,15.5 | U4.P$5 25.55,12.86 26.07,13.38 v26.17,13.38
  Bottom 0.2: v26.17,13.38 26.17,13.48 24.4,15.25 v24.4,15.5
ASEN_DOCK_HIGH_FILT
  Top 0.2: R_FILT2.2 21.5,15.5 21.25,15.75 17.5,15.75 16.95,16.3 16.95,17.12 16.63,17.45 15.69,17.45 13.87,15.62 10.75,15.62 9.88,14.75 9.25,14.75 8.68,15.32 U1.26
ASEN_DOCK_LOW  (via drill 0.3)
  Top 0.2: CFILT2.1 20.5,18 20.75,17.75 22.5,17.75 23.15,18.4 R_FILT1.1 24.08,19.43 24.08,19.52 24.43,19.87 24.93,19.87 25.19,19.62 v25.79,19.62 | U3.P$5 31.55,6.62 31.55,7.28 31.4,7.42 31.13,7.42 v30.85,7.7
  Bottom 0.2: v30.85,7.7 30.85,8.05 30.95,8.15 30.95,16.85 27.93,19.88 26.05,19.88 v25.79,19.62
ASEN_DOCK_LOW_FILT  (via drill 0.3)
  Top 0.2: R_FILT1.2 21.5,18.5 21.25,18.75 v17.75,18.75 | v9.57,15.4 9.28,15.69 8.38,15.69 7.95,16.12 U1.25
  Bottom 0.2: v17.75,18.75 11.45,18.75 9.29,16.59 9.29,16.02 9.57,15.74 v9.57,15.4
ASEN_HOOP_IN
  Top 0.2: CFILT.1 20.5,19.5 20.75,19.25 22.4,19.25 R_FILT3.1 23.4,20.25 29.58,20.25 29.98,19.85 U5.P$5
ASEN_HOOP_IN_FILT  (via drill 0.3)
  Top 0.2: U1.22 9.95,17.87 9.95,18.4 9.5,18.86 v9.5,19 | v16.69,19.47 17.42,20.2 20.6,20.2 20.8,20 R_FILT3.2
  Bottom 0.2: v9.5,19 11.2,19 11.3,19.1 16.32,19.1 v16.69,19.47
ASEN_VDOCK_FILT  (via drill 0.3)
  Top 0.2: R_FILT.2 21.5,17 21.25,17.25 v18,17.25 | U1.19 12.7,17.52 12.7,16.99 13.1,16.59 13.16,16.59 v13.5,16.25
  Bottom 0.2: v18,17.25 17.7,17.25 15.95,15.5 14.25,15.5 v13.5,16.25
CONTR_HB_A1  (via drill 0.3)
  Top 0.152: U1.15 15.68,15.3 15.18,15.3 14.7,14.82 v14.44,14.82
  Bottom 0.152: v14.44,14.82 14.04,14.82 12.89,15.98 12.89,16.52 12.27,17.14 MOTOR.2
CONTR_HB_A2/MOSI  (via drill 0.3)
  Top 0.152: v14.5,13.75 15.67,13.75 U1.13
  Bottom 0.152: MOTOR.3 12.27,16.14 14.5,13.91 v14.5,13.75 14.81,13.44 14.88,13.45 16.68,13.45 20.36,17.14 20.36,19.4 21.39,20.43 21.39,21.09 21.1,21.39 20.48,21.39 20.34,21.25
  Bottom 0.2: U$9.P$1 13.93,20.5 14.69,21.25 20.34,21.25
CONTR_HB_B1  (via drill 0.3)
  Top 0.152: U1.9 15.05,10.52 v13.64,11.93
  Bottom 0.152: MOTOR.4 12.77,15.14 13.9,14.01 13.9,12.19 v13.64,11.93
CONTR_HB_B2  (via drill 0.3)
  Top 0.152: U1.1 8.65,10.15 9,10.5 10.75,10.5 11.89,11.64 v11.89,13.34
  Bottom 0.152: v11.89,13.34 11.89,14.14 MOTOR.5
CONTR_HB_DK_1_DK
  Top 0.152: U1.14 15.72,14.5 16.5,14.5 16.75,14.25 16.75,11.75 17.12,11.38 MELT.2
CONTR_HB_DK_2_HP
  Top 0.152: U1.10 16.68,11.32 17.75,10.25 18.39,10.25 MELT.3
D0/RX
  Top 0.2: U$5.P$1 6.37,12.12 U1.30
D1/TX
  Top 0.2: U$4.P$1 6.22,10.72 6.22,10.87 6.67,11.32 U1.31
DK
  pour Top (no thermals): 22.5,10.25 22.5,10 22.75,9.75 24.25,9.75 25,9 25,8.25 26,8.25 26,9.5 26.25,9.75 26.25,10.4 22.65,10.4
DO_1
  Top 0.5: U4.P$1 29.77,10.28 28.4,8.9 RSDL.2 28.4,7.08 29.02,6.45 U3.P$8
  Top 1: RSDH.1 RSDL.2
DOCK_FINAL
  Top 0.3: U3.P$1 29.77,3.46 31.74,5.42 32.07,5.42 32.25,5.6 32.25,7.3 32.23,7.32 32.23,8.48
  Top 1: RSDL.1 31.96,8.75 | 31.96,8.75 32.23,8.48 DOCK_OUTPUT_PINS.2 | DOCK_OUTPUT_PINS.1 32.25,9.04 31.96,8.75
  Bottom 0.2: R_SENVD_HI.1 DOCK_OUTPUT_PINS.2
DOCK_LEVEL_CHECK  (via drill 0.3)
  Top 0.152: v18.04,13.48 18.04,13.4 19.25,13.4 19.85,14 23.2,14 v23.47,13.72
  Top 0.2: v14.5,11.94 14.68,12.12 U1.11
  Bottom 0.152: RL_DK.1 15.8,11.95 16.2,11.95 17.76,13.51 18.01,13.51 v18.04,13.48
  Bottom 0.2: RL_DK.1 14.54,11.9 v14.5,11.94 | v23.47,13.72 24.53,13.72 26.95,11.3 26.95,11.23 27.3,10.88 27.37,10.88 27.82,10.44 COMPARATOR.P$7
GND  (via drill 0.3, 0.35)
  Top 0.152: CBYP_ISEN_DKH1.2 29.41,13.49 29.41,14.74 U5.P$3 | 29.77,15.89 v29.56,16.1 | U4.P$2 29.94,10.96 29.94,11.57 U4.P$3 29.94,11.64 29.14,11.64 28.95,11.46 28.95,11.44 28.72,11.2 v28.72,10.73 | CBYP_MC_VCC4.2 15.07,19 v16,18.07 16.08,17.99 18.82,17.99 CFILT2.2 | U1.21 11.04,17.61 11.04,18.14 10.66,18.52 10.66,18.98 CBYP_MC_VCC3.2 10.66,19.05 10.66,19.66 | 10.66,19.66 10.66,19.96 11.19,20.49 U$8.P$1 | U1.5 11.79,9.07 11.79,9.68 11.42,10.05 10.66,10.05 10.28,9.68 10.28,9.07 U1.3 10.21,9 10.21,8.47 9.6,7.86 CBYP_MC_VCC1.2 9.6,7.18 9.6,6.03 10.63,5 U$15.BL 10.81,5.07 11.83,5.07 13.9,7.14 CBYP_MC_VCC2.2 13.91,7.18 14.06,7.18 14.89,6.35 16.82,6.35 17.27,6.8 17.27,7.76 16.93,8.09 Y1.2 16.93,8.24 16.93,8.85 17.55,9.46 19.68,9.46 | 18.6,12.7 MELT.1 | CFILT1.2 18.63,15.22 v16.94,15.22 | 19.05,12.78 19.73,12.78 19.75,12.75 | U3.P$2 30.39,2.04 30.39,1.36 30.09,1.06 29.48,1.06 28.73,1.81 28.73,2.01 CBYP_ISEN_DKL1.2 | 26.38,4.91 TO_BUCK.P$3 | 10.66,19.66 9.3,19.66 5.67,16.03 5.67,14.97 4.91,14.21 4.08,14.21
  Top 0.2: U5.P$7 28.68,18.55 29,18.23 29.12,18.23 CBYP_ISEN_HP_1.2 30.22,16.35 29.77,15.89 29.5,15.63 29.5,14.97 U5.P$3 U5.P$2 | U3.P$7 30.27,6.3 30.27,5.65 30.1,5.47 29.45,5.47 29.25,5.67 v29,5.67 | 28.73,2.01 28.73,2.5 28.43,2.8 28.2,2.8 28.05,2.95 28.05,3.18 TO_BUCK.P$4 | MELT.1 17.89,12.65 17.4,13.15 17.4,14.35 18.05,15 CFILT1.2 | CBYP_MC_VCC4.2 16.31,19 16.44,18.87 17.02,18.87 17.5,19.35 18.7,19.35 CFILT.2
  Top 0.3: CBYP_ISEN_DKL1.2 28.81,2.04 29.2,2.04 29.2,1.85 29.25,1.8 29.25,1.2
  Top 0.5: CBYP_HB_DK.2 RILIM_HB_DK.2 21.1,8.9 v21,9 | U3.P$2 30.43,3.18 v30.87,3.62 | U$15.BL 10.33,5.42 10.14,5.42 9.62,5.94 9.62,7.23 CBYP_MC_VCC1.2 | 20.91,12.65 MELT.1 19.59,12.65 v20.25,12
  Top 1: 12.25,5 U$15.BL 10.92,5.17 10.93,5.17 11.54,5.77 11.54,6 | TO_BUCK.P$3 TO_BUCK.P$4 | 20.91,12.65 v21,12.75
  Bottom 0.152: v29.56,16.1 29.22,15.76 | 29.22,15.76 28.8,15.35 28.8,14.21 29.11,13.91 29.11,12.78 COMPARATOR.P$4 | v16,18.07 15.96,18.04 CBYP_HB_MOT.2 | U$8.P$1 11.26,20.56 12.35,21.65 20.21,21.65 20.28,21.72 21.22,21.72 21.7,21.25 21.7,19.43 24.34,16.78 28.2,16.78 29.22,15.76 | 6.58,7.64 7.18,7.64 RVB-PULLDOWN.1 | 6.58,7.64 5.52,8.69 U$1.P$1 | R_VBAT-_LO.2 11.32,8.03 11.32,5.57 10.81,5.07 U$15.BL 10.73,4.99 9.83,4.08 6.35,4.08 5.82,4.61 5.82,5.37 6.58,6.12 6.58,7.64 | v16.94,15.22 19.2,17.48 19.2,17.84 R_LED.2 | v13,13 13.06,12.94 13.06,11.69 13.5,11.25 v20.25,11.25
  Bottom 0.2: v29,5.67 29.4,6.07 CBYP_LV.1 30.25,8.1 R_THRESH_D_LO.2
  Bottom 1: U$15.BL 11.75,5 | U$15.BL 11.5,4.25 11.5,4.09 11.55,4.05 | U$15.BL 10.25,5 | U$14.BL 26.23,5 TO_BUCK.P$3 TO_BUCK.P$4 30.76,3.92 | U$15.BL 10.92,5.17 | 10.92,5.17 10.93,5.17 11.63,5.87 11.63,6.62 11.35,6.9 | 10.92,5.17 9.83,4.08
  other vias: 21.75,11.25 20.25,9.75 21.75,9.75 21,10.5 21.75,10.5 20.25,10.5 21,11.25 21,12 21.75,12 29.11,4.36 17.8,16.4 24.5,16.75 28,17.25 8.5,20.5 21.25,1.5 27.55,11.48 12.75,4.25 20.25,8.25 21,8.25 21.75,8.25 21.75,9 20.25,9 21,9.75 20.62,13.38 20.25,12.75 21.37,13.38 21.75,12.75
  pour Top (no thermals): 20,13 22,13 22,12.25 22.33,11.92 23.98,11.92 24.8,11.1 26.3,11.1 26.3,10.8 26.2,10.7 22.4,10.7 22.2,10.5 22.2,8.55 23,7.75 23,4.5 22.5,4 21.75,4 21.25,4.5 21.25,6 20.5,6.75 20.5,8 19.75,8.75 19.75,12.75
  pour Top (rank 6): 0,24.75 0,0 3.75,-3.75 5.75,-5.75 39.25,-5.75 42.5,-2.5 42.5,3 42.5,17.5 34.5,25.5 0.75,25.5
  pour Bottom (rank 6): 1,24 1,-0.25 4.5,-3.75 32.5,-3.75 32.75,-3.5 33.25,-3.5 39,2.25 39,18.5 37.75,19.75 37.75,23.5 35.25,26 2.75,26 1,24.25
HOOP_FINAL  (via drill 0.3)
  Top 0.2: v27.1,16 26.1,16 RSHL.1 | U5.P$8 27.97,19.13 27.37,19.13 26.46,18.22 HOOP_OUTPUT_PIN.1
  Top 1: RSHL.1 HOOP_OUTPUT_PIN.1
  Bottom 0.2: COMPARATOR.P$3 28.46,13.75 28.16,14.05 27.65,14.05 27.5,14.2 27.5,15.6 v27.1,16
HOOP_LEVEL_CHECK  (via drill 0.3)
  Top 0.152: v14.5,12.84 14.58,12.92 U1.12 | v18.75,14 19.05,14.3 23.17,14.3 23.39,14.52 v24.09,14.52
  Bottom 0.152: v14.5,12.84 v14.51,12.85 RL_HP.2 15.8,12.85 16.56,12.85 17.8,14.09 18.67,14.09 v18.75,14 | COMPARATOR.P$1 27.14,12.78 25.96,12.78 24.22,14.52 v24.09,14.52
HP  (via drill 0.3)
  Top 0.2: v27.98,16.04 27.98,14.84 U5.P$1 | MELT.8 25.22,14.4 RSHL.2
  Bottom 0.2: HPPULUP.1 27.98,14.87 v27.98,16.04
  pour Top (isolate 0.1, no thermals): 22.5,13 22.5,12.25 24.25,12.25 24.5,12.5 25.75,13.75 26,14 26.5,14 28.25,14 28.25,15.5 27.75,15.5 27.5,15.5 27,15 25.5,15 23.75,13.25 23.5,13
ILIM_HI
  Top 0.5: MELT.4 19.4,7.97 RILIM_HB_DK.1
MARM+
  Bottom 0.5: M1OUT.1 5.1,16.12 6.73,16.12 MOTOR.8
MARM-
  Bottom 0.5: M1OUT.2 4.5,13.58 6.06,15.14 MOTOR.7
MHOOP+
  Bottom 0.5: M2OUT.1 6.54,19.92 6.54,18.14 MOTOR.10
MHOOP-
  Bottom 0.5: MOTOR.9 6.69,17.2 5.24,17.2 4.95,17.49 M2OUT.2
MISO_DEBUGLED  (via drill 0.3)
  Top 0.2: U1.16 16.1,16.52 16.1,16.66 v16.27,16.83 | v16.27,16.83
  Bottom 0.2: v16.27,16.83 16.49,17.04 16.85,17.04 17.93,18.12 18.01,18.12 18.38,18.49 18.38,19.17 17.62,19.93 D1.A U$2.P$1
POST_LED
  Bottom 0.152: R_LED.1 19.28,19.2 19.28,20.41 19.35,20.49 D1.C
SCK
  Top 0.152: U1.17 14.25,19.75 U$3.P$1
SCL  (via drill 0.3, 0.35)
  Top 0.2: U1.28 8.8,13.72 10.26,12.25 v10.26,11.5 | U$14.BR 17.75,4.5 15,4.5 v14.5,5
  Bottom 0.2: v10.26,11.5 10.54,11.22 10.69,11.22 12.15,9.77 12.15,8.11 14.5,5.76 v14.5,5
SDA  (via drill 0.3, 0.35)
  Top 0.2: U1.27 8.53,14.52 v11.15,11.9 | U$14.UR 15.61,3 13.87,4.74 13.87,5.26 14.24,5.63 15.11,5.63 v15.16,5.68
  Bottom 0.2: v11.15,11.9 11.15,11.36 12.57,9.94 12.57,8.27 v15.16,5.68
SEN_ARMLIM
  Top 0.3: U1.2 | U1.2 9.45,8.4 9,7.95 8.26,7.95 5.8,5.48 5.8,4.49 6.75,3.53 U$15.UR
SEN_VB-_EN  (via drill 0.3)
  Top 0.2: U1.32 7.25,10.47 v7.25,9.75
  Bottom 0.2: RVB-PULLDOWN.2 v7.25,9.75 8.18,10.68 U$6.P$1
SEN_VBAT-  (via drill 0.3)
  Top 0.2: v9.92,16.28 9.82,16.28 9.45,16.65 U1.23
  Bottom 0.2: R_VBAT-_LO.1 10.2,10.45 U$6.P$2 9.64,11.24 9.64,11.76 10.2,12.33 10.2,16 v9.92,16.28
V+
  Top 1: MELT.5 24.1,8.22 CBYP_HB_DK.1 24.1,5.7 arc-45 23.31,3.8 22.51,3 U$14.UL 26.23,3 TO_BUCK.P$5 TO_BUCK.P$6
VB-AFTERRES
  Bottom 0.2: R_VBAT-_HI.1 9.25,8.4 U$6.P$3
VBAT+
  Top 1: U$15.BM U$15.UL 11.26,2.49 arc45 13.22,1.68 18.34,1.68 arc45 19.57,2.19 20.25,2.87 U$14.UM
VBAT-
  Top 1: U$15.BR U$15.UM
  Bottom 0.2: U$15.BR 8.6,6.85 R_VBAT-_HI.2
  Bottom 1: U$15.UM 9.55,2.2 arc45 10.77,1.7 arc45 14.06,3.06 16.65,5.65 arc-45 18.28,6.33 arc-45 19.37,5.88 U$14.BM
VDMEAS  (via drill 0.3)
  Top 0.2: CFILT3.1 20.5,16.5 20.75,16.25 22.4,16.25 R_FILT.1 24.68,18.53 v24.68,19.27
  Bottom 0.2: R_SENVD_HI.2 R_SENVD_LO.1 | R_SENVD_HI.2 32.25,5.65 29.87,5.65 29.26,5.04 28.74,5.04 28.37,5.41 28.37,5.93 28.8,6.36 28.8,7.8 29.11,8.12 COMPARATOR.P$5 | R_SENVD_HI.2 32.28,5.75 33.49,6.96 33.49,11.51 31.3,13.7 31.3,17.05 28.11,20.25 25.57,20.25 24.68,19.36 v24.68,19.27
VREF_COMP
  Bottom 0.2: COMPARATOR.P$2 27.99,12.56 27.99,11.96 28.6,11.35 R_THRESH_D_HI.1 R_THRESH_D_LO.1 28.98,9.9 28.64,9.56 28.64,8.96 COMPARATOR.P$6
XTAL1/TOSC1
  Top 0.2: U1.7 | U1.7 13.45,8.35 13.78,8.02 14.37,8.02 15.4,6.98 Y1.1
XTAL2/TOSC2
  Top 0.2: U1.8 14.5,9.32 15.77,9.32 Y1.3

### Text on the board
tPlace: RG5IKO | bp | A/H | C0.1u | R5.6k | GTR | bp | 5V | bp | ilim | G | V+
bPlace: OKI5GR | 100k | Dock | 49.9k | 5.6k | 20190621 | Petras Swissler | bp | 10k | 100k | 15k